# Altium schematic sheet NODEMCU_ESP12.SchDoc: NODE MCU ESP12
size A4; Date: 20/11/2014; Author: HuangRui <vowstar@gmail.com>; DrawnBy: JiYaping <jyp1817@gmail.com>; Organization: WWW.NODEMCU.COM
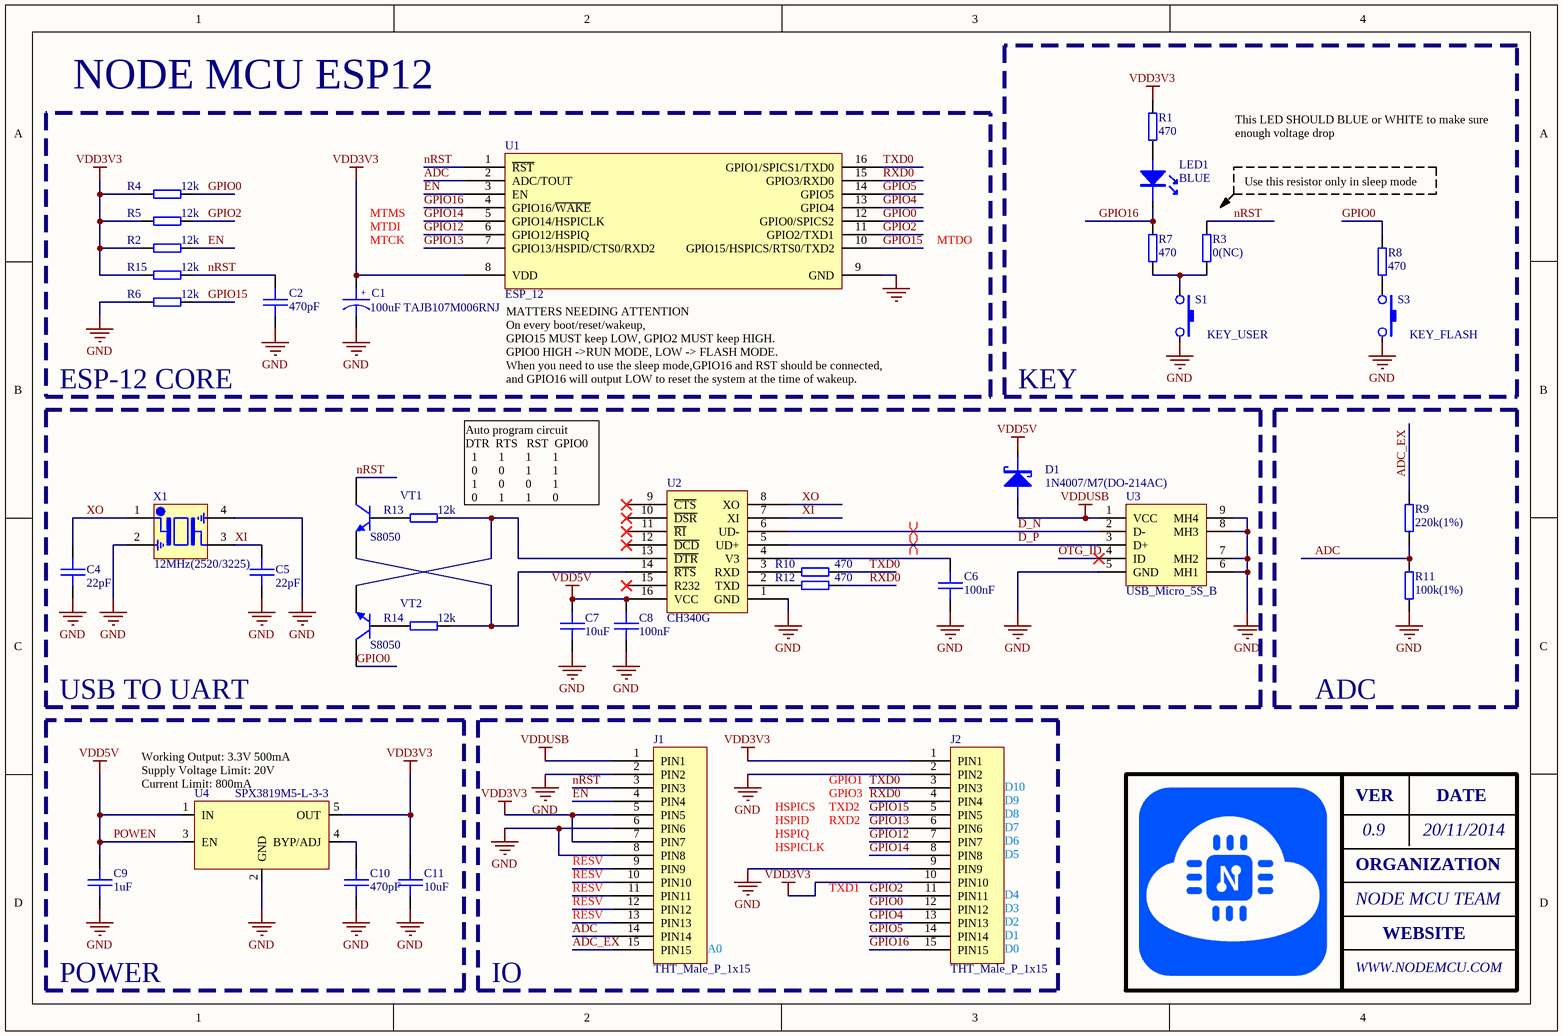
[diagram p0: NODEMCU_ESP12.SchDoc]

## Parts
C1  100uF TAJB107M006RNJ  [SMT_C_Tantalum_B]
C2  470pF  [SMT_C_0402]
C4  22pF  [SMT_C_0402]
C5  22pF  [SMT_C_0402]
C6  100nF  [SMT_C_0402]
C7  10uF  [SMT_C_0402]
C8  100nF  [SMT_C_0402]
C9  1uF  [SMT_C_0402]
C10  470pF  [SMT_C_0402]
C11  10uF  [SMT_C_0402]
D1  1N4007/M7(DO-214AC)  [SMT_DIODE_DO_214AC]
J1  THT_Male_P_1x15  [THT_Male_P_1x15-2.54mm]
J2  THT_Male_P_1x15  [THT_Male_P_1x15-2.54mm]
LED1  BLUE  [SMT_LED_0603]
R1  470  [SMT_R_0402]
R2  12k  [SMT_R_0402]
R3  0(NC)  [SMT_R_0402]
R4  12k  [SMT_R_0402]
R5  12k  [SMT_R_0402]
R6  12k  [SMT_R_0402]
R7  470  [SMT_R_0402]
R8  470  [SMT_R_0402]
R9  220k(1%)  [SMT_R_0402]
R10  470  [SMT_R_0402]
R11  100k(1%)  [SMT_R_0402]
R12  470  [SMT_R_0402]
R13  12k  [SMT_R_0402]
R14  12k  [SMT_R_0402]
R15  12k  [SMT_R_0402]
S1  KEY_USER  [SMT_SW_PTS_820]
S3  KEY_FLASH  [SMT_SW_PTS_820]
U1  ESP_12  [ESP_12]
U2  CH340G  [SOP-16]
U3  USB_Micro_5S_B  [USB_MICRO_5S_B]
U4  SPX3819M5-L-3-3  [SOT23-5]
VT1  S8050  [SMT_TRIODE_NPN]
VT2  S8050  [SMT_TRIODE_NPN]
X1  12MHz(2520/3225)  [SMT_XTAL_2520]

## Blocks framed on the sheet
KEY: LED1 R1 R3 R7 R8 S1 S3
ESP-12 CORE: C1 C2 R2 R4-R6 R15 U1
USB TO UART: C4-C8 D1 R10 R12-R14 U2 U3 VT1 VT2 X1
ADC: R9 R11
IO: J1 J2

## Nets
GND: C1.2 C2.2 C4.2 C5.2 C6.2 C7.2 C8.2 C9.2 C10.2 C11.2 J1.2(PIN2) J1.6(PIN6) J1.8(PIN8) J2.2(PIN2) J2.9(PIN9) R6.1 R11.1 S1.2 S3.2 U1.9(GND) U2.1(GND) U3.5(GND) U3.6(MH1) U3.7(MH2) U3.8(MH3) U3.9(MH4) U4.2(GND) X1.2(GND) X1.4(GND)
POWEN: C7.1 C8.1 C9.1 D1.2(K) U2.16(VCC) U4.1(IN) U4.3(EN)  [also labelled VDD5V]
VDD3V3: C1.1 C11.1 J1.5(PIN5) J1.7(PIN7) J2.1(PIN1) J2.10(PIN10) R1.2 R2.1 R4.1 R5.1 R15.1 U1.8(VDD) U4.5(OUT)
VDDUSB: D1.1(A) J1.1(PIN1) U3.1(VCC)
ADC: J1.14(PIN14) R9.1 R11.2 U1.2(ADC/TOUT)
ADC_EX: J1.15(PIN15) R9.2
D_N: U2.6(UD-) U3.2(D-)
D_P: U2.5(UD+) U3.3(D+)
EN: J1.4(PIN4) R2.2 U1.3(EN)
GPIO0: J2.12(PIN12) R4.2 R8.2 U1.12(GPIO0/SPICS2) VT2.3(C)
GPIO2: J2.11(PIN11) R5.2 U1.11(GPIO2/TXD1)
GPIO4: J2.13(PIN13) U1.13(GPIO4)
GPIO5: J2.14(PIN14) U1.14(GPIO5)
GPIO12: J2.7(PIN7) U1.6(GPIO12/HSPIQ)
GPIO13: J2.6(PIN6) U1.7(GPIO13/HSPID/CTS0/RXD2)
GPIO14: J2.8(PIN8) U1.5(GPIO14/HSPICLK)
GPIO15: J2.5(PIN5) R6.2 U1.10(GPIO15/HSPICS/RTS0/TXD2)
GPIO16: J2.15(PIN15) LED1.2(K) R7.2 U1.4(GPIO16/~{WAKE})
nRST: C2.1 J1.3(PIN3) R3.2 R15.2 U1.1(~{RST}) VT1.3(C)
OTG_ID: U3.4(ID)
RXD0: J2.4(PIN4) R12.1 U1.15(GPIO3/RXD0)
TXD0: J2.3(PIN3) R10.1 U1.16(GPIO1/SPICS1/TXD0)
XI: C5.1 U2.7(XI) X1.3(IN/OUT)
XO: C4.1 U2.8(XO) X1.1(IN/OUT)
NetC6_1: C6.1 U2.4(V3)
NetC10_1: C10.1 U4.4(BYP/ADJ)
NetLED1_1: LED1.1(A) R1.1
NetR3_1: R3.1 R7.1 S1.1
NetR8_1: R8.1 S3.1
NetR10_2: R10.2 U2.3(RXD)
NetR12_2: R12.2 U2.2(TXD)
NetR13_1: R13.1 VT1.1(B)
NetR13_2: R13.2 U2.13(~{DTR}) VT2.2(E)
NetR14_1: R14.1 VT2.1(B)
NetR14_2: R14.2 U2.14(~{RTS}) VT1.2(E)

Not connected (* = marked no-connect by the designer): J1 9(PIN9) 10(PIN10) 11(PIN11) 12(PIN12) 13(PIN13); U2 9(~{CTS})* 10(~{DSR})* 11(~{RI})* 12(~{DCD})* 15(R232)*

## Layout directives
differential pair: D_N, D_P

## Notes on the sheet
- This LED SHOULD BLUE or WHITE to make sure enough voltage drop
- (near C1) MTCK
- MTDI
- MTMS
- MTDO
- Use this resistor only in sleep mode
- (near U1) MATTERS NEEDING ATTENTION
  On every boot/reset/wakeup,
  GPIO15 MUST keep LOW, GPIO2 MUST keep HIGH.
  GPIO0 HIGH ->RUN MODE, LOW -> FLASH MODE.
  When you need to use the sleep mode,GPIO16 and RST should be connected,
  and GPIO16 will output LOW to reset the system at the time of wakeup.
- (near R13) Auto program circuit
  DTR  RTS   RST  GPIO0
  1       1       1       1
  0       0       1       1
  1       0       0       1
  0       1       1       0
- (near U4) Working Output: 3.3V 500mA
  Supply Voltage Limit: 20V
  Current Limit: 800mA
- GPIO1
- D10
- HSPICLK
- HSPIQ
- HSPID
- HSPICS
- TXD2
- RXD2
- GPIO3
- D6
- D7
- D8
- D9
- VER
- 0.9
- DATE
- RESV
- TXD1
- D2
- D3
- D4
- D5
- ORGANIZATION
- NODE MCU TEAM
- POWER
- A0
- D0
- D1
- WEBSITE
- (in symbol SMT_C_Tantalum_B) +

## Library data of the parts
C1 = SMT_C_Tantalum_B: Capacitor, SM Tantalum; Body 3.5 x 2.8 mm (LxW typ)
C2 C4-C11 = SMT_C_0402: Surface mount capacitor 0402
D1 = SMT_DIODE_SCHOTTKY_DO_214AC: Surface mount schottky diode DO-214AC(SMA) Package
J1 J2 = THT_Male_P_1x15: THT Male pin header strip 1x15
LED1 = SMT_LED_0603: SMT LED
R1-R15 = SMT_R_0402: Surface mount resistor 0402
S1 S3 = SMT_SW_PTS_820: SMT Tactile ‎Switch PTS 820 Series
U1 = ESP_12: ESP-12 Wi-Fi Module by AI-Thinker; IC: ESP8266-EX; Vendor: Ai-thinker
U2 = CH340G: CH340G USB to serial (UART) bridge
U3 = USB_Micro_5S_B: USB micro female SMT with 4 fixed foot
U4 = SPX3819: 500mA, Low-Noise LDO Voltage Regulator
VT1 VT2 = SMT_TRIODE_NPN: Surface mount NPN transistor, package SOT-23
X1 = SMT_XTAL_PASSIVE: Passive crystal